# EasyEDA Pro project Ea-nāṣir ab.epro

# Schematic LM393DREOL_1
Board Name: LM393DREOL; Create Date: 2025-11-28; Page Name: P1; Project Name: LM393DREOL; Schematic Name: LM393DREOL; Update Date: 2025-11-29; Company: EasyEDA.com; Page Size: A4; Version: V1.0
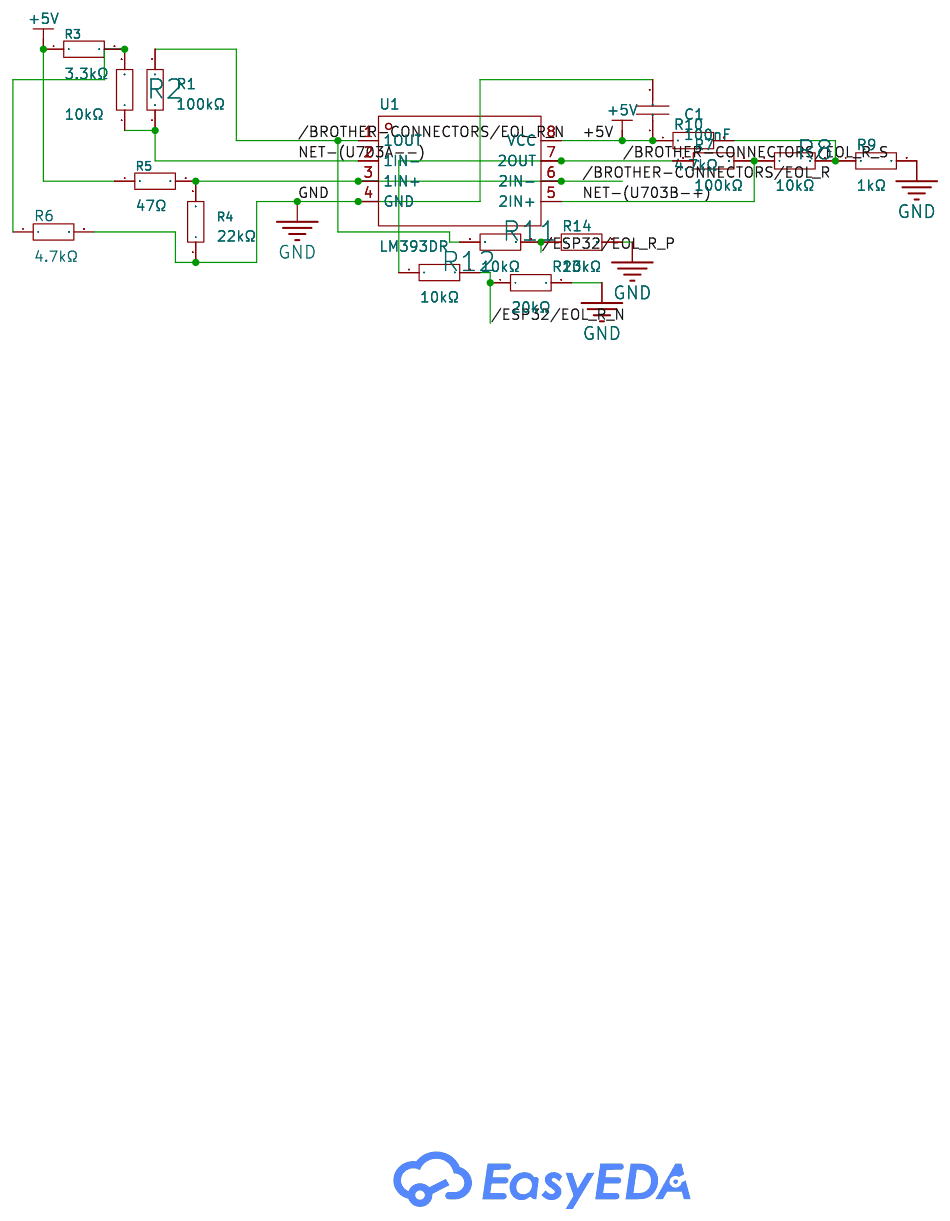
[diagram p0: schematic sheet]

## Parts
C1  100nF  [C0603]
R1  100kΩ  [R0603]
R2  10kΩ  [R0603]
R3  3.3kΩ  [R0603]
R4  22kΩ  [R0603]
R5  47Ω  [R0603]
R6  4.7kΩ  [R0603]
R7  100kΩ  [R0603]
R8  10kΩ  [R0603]
R9  1kΩ  [R0603]
R10  4.7kΩ  [R0603]
R11  10kΩ  [R0603]
R12  10kΩ  [R0603]
R13  20kΩ  [R0603]
R14  20kΩ  [R0603]
U1  LM393DR  [SOIC-8_L5.0-W4.0-P1.27-LS6.0-BL]

## Library data of the parts
C1 = CL10B104KA8NNNC: Capacitance:100nF Tolerance:±10% Tolerance:±10% Voltage Rating:25V Temperature Coefficient:X7R; LCSC Part Name: 100nF ±10% 25V; Supplier Part: C1590; Manufacturer: SAMSUNG(三星); Supplier Footprint: 0603; JLCPCB Part Class: Extended Part; Datasheet: https://item.szlcsc.com/datasheet/CL10B104KA8NNNC/1942.html; Supplier: LCSC; Tolerance: ±10%; Voltage Rating: 25V; Temperature Coefficient: X7R
R1 R7 = 0603WAF1003T5E: Type:Thick Film Resistor Resistance:100kΩ Tolerance:±1% Tolerance:±1% Power(Watts):100mW Voltage-Supply(Max):75V Temperature Coefficient:±100ppm/℃ Temperature Coefficient:±100ppm/℃ Operating Temperature:-55℃~+155℃ Operating Temperature:-55℃~+155℃; LCSC Part Name: 100kΩ ±1% 100mW 厚膜电阻; Supplier Part: C25803; Manufacturer: UNI-ROYAL(厚声); Supplier Footprint: 0603; JLCPCB Part Class: Basic Part; Datasheet: https://item.szlcsc.com/datasheet/0603WAF1003T5E/26546.html; Supplier: LCSC; Type: Thick Film Resistor; Tolerance: ±1%; Power(Watts): 100mW; Voltage-Supply(Max): 75V; Temperature Coefficient: ±100ppm/℃; Operating Temperature: -55℃~+155℃
R2 R8 R11 R12 = 0603WAF1002T5E: Type:Thick Film Resistor Resistance:10kΩ Tolerance:±1% Tolerance:±1% Power(Watts):100mW Voltage-Supply(Max):75V Temperature Coefficient:±100ppm/℃ Temperature Coefficient:±100ppm/℃ Operating Temperature:-55℃~+155℃ Operating Temperature:-55℃~+155℃; LCSC Part Name: 厚膜电阻 10kΩ ±1% 100mW; Supplier Part: C25804; Manufacturer: UNI-ROYAL(厚声); Supplier Footprint: 0603; JLCPCB Part Class: Basic Part; Datasheet: https://item.szlcsc.com/datasheet/0603WAF1002T5E/26547.html; Supplier: LCSC; Type: Thick Film Resistor; Tolerance: ±1%; Power(Watts): 100mW; Voltage-Supply(Max): 75V; Temperature Coefficient: ±100ppm/℃; Operating Temperature: -55℃~+155℃
R3 = 0603WAF3301T5E: Type:Thick Film Resistor Resistance:3.3kΩ Tolerance:±1% Tolerance:±1% Power(Watts):100mW Voltage-Supply(Max):75V Temperature Coefficient:±100ppm/℃ Temperature Coefficient:±100ppm/℃ Operating Temperature:-55℃~+155℃ Operating Temperature:-55℃~+155℃; LCSC Part Name: 3.3kΩ ±1% 100mW 厚膜电阻; Supplier Part: C22978; Manufacturer: UNI-ROYAL(厚声); Supplier Footprint: 0603; JLCPCB Part Class: Basic Part; Datasheet: https://item.szlcsc.com/datasheet/0603WAF3301T5E/23705.html; Supplier: LCSC; Type: Thick Film Resistor; Tolerance: ±1%; Power(Watts): 100mW; Voltage-Supply(Max): 75V; Temperature Coefficient: ±100ppm/℃; Operating Temperature: -55℃~+155℃
R4 = 0603WAF2202T5E: Type:Thick Film Resistor Resistance:22kΩ Tolerance:±1% Tolerance:±1% Power(Watts):100mW Voltage-Supply(Max):75V Temperature Coefficient:±100ppm/℃ Temperature Coefficient:±100ppm/℃ Operating Temperature:-55℃~+155℃ Operating Temperature:-55℃~+155℃; LCSC Part Name: 22kΩ ±1% 100mW 厚膜电阻; Supplier Part: C31850; Manufacturer: UNI-ROYAL(厚声); Supplier Footprint: 0603; JLCPCB Part Class: Basic Part; Datasheet: https://item.szlcsc.com/datasheet/0603WAF2202T5E/32812.html; Supplier: LCSC; Type: Thick Film Resistor; Tolerance: ±1%; Power(Watts): 100mW; Voltage-Supply(Max): 75V; Temperature Coefficient: ±100ppm/℃; Operating Temperature: -55℃~+155℃
R5 = 0603WAF470JT5E: Type:Thick Film Resistor Resistance:47Ω Tolerance:±1% Tolerance:±1% Power(Watts):100mW Voltage-Supply(Max):75V Temperature Coefficient:±100ppm/℃ Temperature Coefficient:±100ppm/℃ Operating Temperature:-55℃~+155℃ Operating Temperature:-55℃~+155℃; LCSC Part Name: 47Ω ±1% 100mW 厚膜电阻; Supplier Part: C23182; Manufacturer: UNI-ROYAL(厚声); Supplier Footprint: 0603; JLCPCB Part Class: Basic Part; Datasheet: https://item.szlcsc.com/datasheet/0603WAF470JT5E/23909.html; Supplier: LCSC; Type: Thick Film Resistor; Tolerance: ±1%; Power(Watts): 100mW; Voltage-Supply(Max): 75V; Temperature Coefficient: ±100ppm/℃; Operating Temperature: -55℃~+155℃
R6 R10 = 0603WAF4701T5E: Type:Thick Film Resistor Resistance:4.7kΩ Tolerance:±1% Tolerance:±1% Power(Watts):100mW Voltage-Supply(Max):75V Temperature Coefficient:±100ppm/℃ Temperature Coefficient:±100ppm/℃ Operating Temperature:-55℃~+155℃ Operating Temperature:-55℃~+155℃; LCSC Part Name: 4.7kΩ ±1% 100mW 厚膜电阻; Supplier Part: C23162; Manufacturer: UNI-ROYAL(厚声); Supplier Footprint: 0603; JLCPCB Part Class: Basic Part; Datasheet: https://item.szlcsc.com/datasheet/0603WAF4701T5E/23889.html; Supplier: LCSC; Type: Thick Film Resistor; Tolerance: ±1%; Power(Watts): 100mW; Voltage-Supply(Max): 75V; Temperature Coefficient: ±100ppm/℃; Operating Temperature: -55℃~+155℃
R9 = 0603WAF1001T5E: Type:Thick Film Resistor Resistance:1kΩ Tolerance:±1% Tolerance:±1% Power(Watts):100mW Voltage-Supply(Max):75V Temperature Coefficient:±100ppm/℃ Temperature Coefficient:±100ppm/℃ Operating Temperature:-55℃~+155℃ Operating Temperature:-55℃~+155℃; LCSC Part Name: 1kΩ ±1% 100mW 厚膜电阻; Supplier Part: C21190; Manufacturer: UNI-ROYAL(厚声); Supplier Footprint: 0603; JLCPCB Part Class: Basic Part; Datasheet: https://item.szlcsc.com/datasheet/0603WAF1001T5E/21904.html; Supplier: LCSC; Type: Thick Film Resistor; Tolerance: ±1%; Power(Watts): 100mW; Voltage-Supply(Max): 75V; Temperature Coefficient: ±100ppm/℃; Operating Temperature: -55℃~+155℃
R13 R14 = 0603WAF2002T5E: Type:Thick Film Resistor Resistance:20kΩ Tolerance:±1% Tolerance:±1% Power(Watts):100mW Voltage-Supply(Max):75V Temperature Coefficient:±100ppm/℃ Temperature Coefficient:±100ppm/℃ Operating Temperature:-55℃~+155℃ Operating Temperature:-55℃~+155℃; LCSC Part Name: 20kΩ ±1% 100mW 厚膜电阻; Supplier Part: C4184; Manufacturer: UNI-ROYAL(厚声); Supplier Footprint: 0603; JLCPCB Part Class: Basic Part; Datasheet: https://item.szlcsc.com/datasheet/0603WAF2002T5E/4591.html; Supplier: LCSC; Type: Thick Film Resistor; Tolerance: ±1%; Power(Watts): 100mW; Voltage-Supply(Max): 75V; Temperature Coefficient: ±100ppm/℃; Operating Temperature: -55℃~+155℃
U1 = LM393DR: Number of Channels:2 Vos - Input Offset Voltage:2mV Ib - Input Bias Current:25nA Propagation Delay Time:1.3us Input Hysteresis Voltage (Vhys):- Common Mode Rejection Ratio(CMRR):- Output Type:- Output Type:TTL；CMOS Quiescent Current:400uA Operating Temper; LCSC Part Name: 双通道差分比较器; Supplier Part: C67470; Manufacturer: TI(德州仪器); Supplier Footprint: SOIC-8; JLCPCB Part Class: Extended Part; Datasheet: https://www.ti.com/cn/lit/gpn/lm393; Supplier: LCSC; Number of Channels: 2; Vos - Input Offset Voltage: 2mV; Ib - Input Bias Current: 25nA; Propagation Delay Time: 1.3us; Output Type: TTL；CMOS; Quiescent Current: 400uA; Operating Temperature: 0℃~+70℃

## Nets
+5V: C1.1 R3.1 R5.1 R10.1 U1.8(VCC)
GND: C1.2 R4.1 R6.2 R9.2 R13.2 R14.2 U1.4(GND)
/BROTHER-CONNECTORS/EOL_R: R4.2 R5.2 U1.3(1IN+) U1.6(2IN-)
/BROTHER-CONNECTORS/EOL_R_N: R1.2 R11.1 U1.1(1OUT)
/BROTHER-CONNECTORS/EOL_R_S: R7.1 R12.1 U1.7(2OUT)
/ESP32/EOL_R_N: R12.2 R13.1
/ESP32/EOL_R_P: R11.2 R14.1
NET-(U703A--): R1.1 R2.1 U1.2(1IN-)
NET-(U703B-+): R7.2 R8.1 U1.5(2IN+)
$1N476: R2.2 R3.2 R6.1
$1N1029: R8.2 R9.1 R10.2

# Board LM393DREOL_1
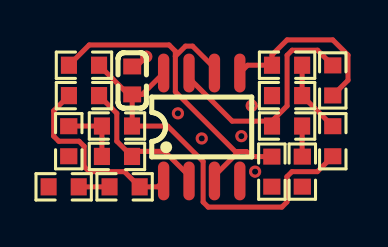
[diagram p1: board, top side]
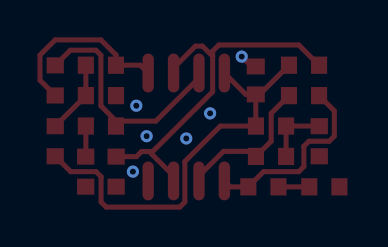
[diagram p2: board, bottom side, seen from below]

No outline. copper layers: Top Layer, Bottom Layer. Coordinates in mm from the lowest, leftmost part position.
Stack: Top Layer 0.035mm / Dielectric1 1.51mm FR4 er 4.5 / Bottom Layer 0.035mm

## Design rules (mm)
template: JLCPCB Capability(Two Layers Board)
spacing copperThickness1oz (default): track to track 0.102, other pairs 0.152 to 0.3
spacing copperThickness2oz: track to track 0.203, other pairs 0.152 to 0.3
track width copperThickness1oz (default): min 0.127, default 0.254, max 2.54
track width copperThickness2oz: min 0.203, default 0.254, max 2.54
differential pair differentialPair (default): width min 0.127, default 0.254, max 2.54; gap min 0.152, default 0.152
via viaSize (default): diameter min 0.5, default 0.61, max 10; hole min 0.3, default 0.305, max 6.3

## Placement (name value [footprint] x y rotation side)
C1  100nF  [C0603]  3.43 5.33 90 top
R1  100kΩ  [R0603]  1.02 4.57 180 top
R2  10kΩ  [R0603]  2.67 1.52 180 top
R3  3.3kΩ  [R0603]  2.67 3.05 180 top
R4  22kΩ  [R0603]  10.41 0.76 90 top
R5  47Ω  [R0603]  1.02 6.1 180 top
R6  4.7kΩ  [R0603]  0.25 2.29 270 top
R7  100kΩ  [R0603]  13.46 5.33 270 top
R8  10kΩ  [R0603]  11.18 6.1 0 top
R9  1kΩ  [R0603]  11.18 4.57 180 top
R10  4.7kΩ  [R0603]  13.46 2.29 90 top
R11  10kΩ  [R0603]  3.05 0 180 top
R12  10kΩ  [R0603]  11.18 3.05 0 top
R13  20kΩ  [R0603]  11.94 0.76 270 top
R14  20kΩ  [R0603]  0 0 180 top
U1  LM393DR  [SOIC-8_L5.0-W4.0-P1.27-LS6.0-BL]  6.91 3 0 top

## Footprints (pads in the part's own frame, mm; a bottom-side part is the same pattern mirrored in y, then rotated)
C0603
  rect 0.8x0.9 smd: 1(-0.7,0) 2(0.7,0)
R0603
  rect 0.806x0.864 smd: 1(-0.753,0) 2(0.753,0)
SOIC-8_L5.0-W4.0-P1.27-LS6.0-BL
  oval 0.569x1.95 smd: 1(-1.905,-2.705) 2(-0.635,-2.705) 3(0.635,-2.705) 4(1.905,-2.705) 5(1.905,2.705) 6(0.635,2.705) 7(-0.635,2.705) 8(-1.905,2.705)

## Nets
As in the schematic.

## Via types
v1: diameter 0.61, hole 0.305, Top Layer to Bottom Layer, 6 vias

## Routing (per net, layer and track width the routed paths; a pad name or vN(x,y) marks a point on that pad's centre or on a via; arc(x,y) is an arc through that point)
+5V: length 20.6
  Top Layer w0.254: C1.1 3.23,4.63 R5.1 ; C1.1 3.93,4.63 U1.8 ; C1.1 3.43,3.06 R3.1 5.2,3.05 6.98,1.27 6.98,-0.76 7.23,-1.02 10.91,-1.02 11.17,-0.76 11.17,0.51 11.42,0.76 12.69,0.76 R10.1
GND: length 0.9
  Top Layer w0.254: 3.43,6.03 3.64,6.03 v1(4.13,6.53)
  vias: v1(5.72,3.68) v1(6.91,2.43) v1(8.89,2.54) v1(9.41,4.07) v1(9.58,0.76)
/BROTHER-CONNECTORS/EOL_R: length 18.9
  Top Layer w0.254: 7.54,0.3 7.54,0.55 8.76,1.77 ; 5.59,6.55 5.59,6.8 5.27,7.11 1.28,7.11 R5.2 ; 5.59,6.55 5.59,4.77 8.58,1.77 8.76,1.77 ; 5.59,6.55 6.09,7.05 6.45,7.05 7.54,5.96 U1.6 ; R4.2 9.4,1.52 9.14,1.77 8.76,1.77
/BROTHER-CONNECTORS/EOL_R_N: length 9.6
  Top Layer w0.254: 5,0.3 4.71,0 R11.1 3.04,0.76 1.28,0.76 1.02,1.02 1.02,2.03 0.77,2.29 -0.25,2.29 -0.5,2.54 -0.5,3.81 R1.2
/BROTHER-CONNECTORS/EOL_R_S: length 11.9
  Top Layer w0.254: R7.1 12.7,6.85 11.43,6.85 11.18,6.6 11.18,4.06 10.41,3.29 ; R12.1 10.41,3.06 10.41,3.29 ; 10.41,3.29 8.43,3.29 6.35,5.37 6.35,5.63 U1.7
/ESP32/EOL_R_N: length 1.5
  Top Layer w0.254: R12.2 11.93,1.52 R13.1
/ESP32/EOL_R_P: length 1.5
  Top Layer w0.254: R11.2 R14.1
NET-(U703A--): length 7.5
  Top Layer w0.254: 6.27,0.3 6.27,0.55 5.04,1.78 3.67,1.78 R2.1 2.66,2.29 2.66,3.68 R1.1
NET-(U703B-+): length 9.1
  Top Layer w0.254: R7.2 14.22,5.34 14.22,6.6 13.46,7.37 11.18,7.37 10.42,6.61 R8.1 9.2,6.1 U1.5
$1N476: length 3.2
  Top Layer w0.254: R6.1 0.26,3.05 R3.2 R2.2
$1N1029: length 3.7
  Top Layer w0.254: R10.2 R9.1 R8.2

# Board PCB1
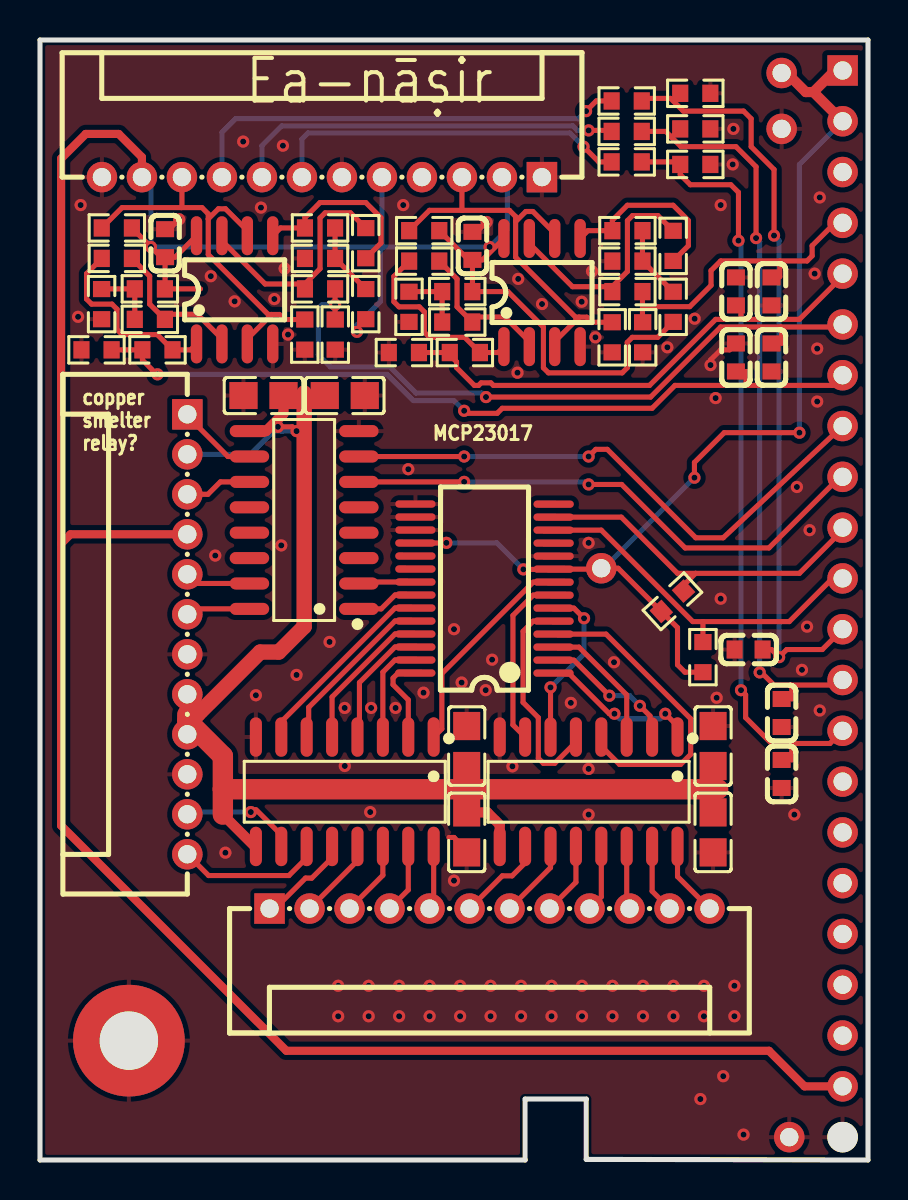
[diagram p3: board, top side]
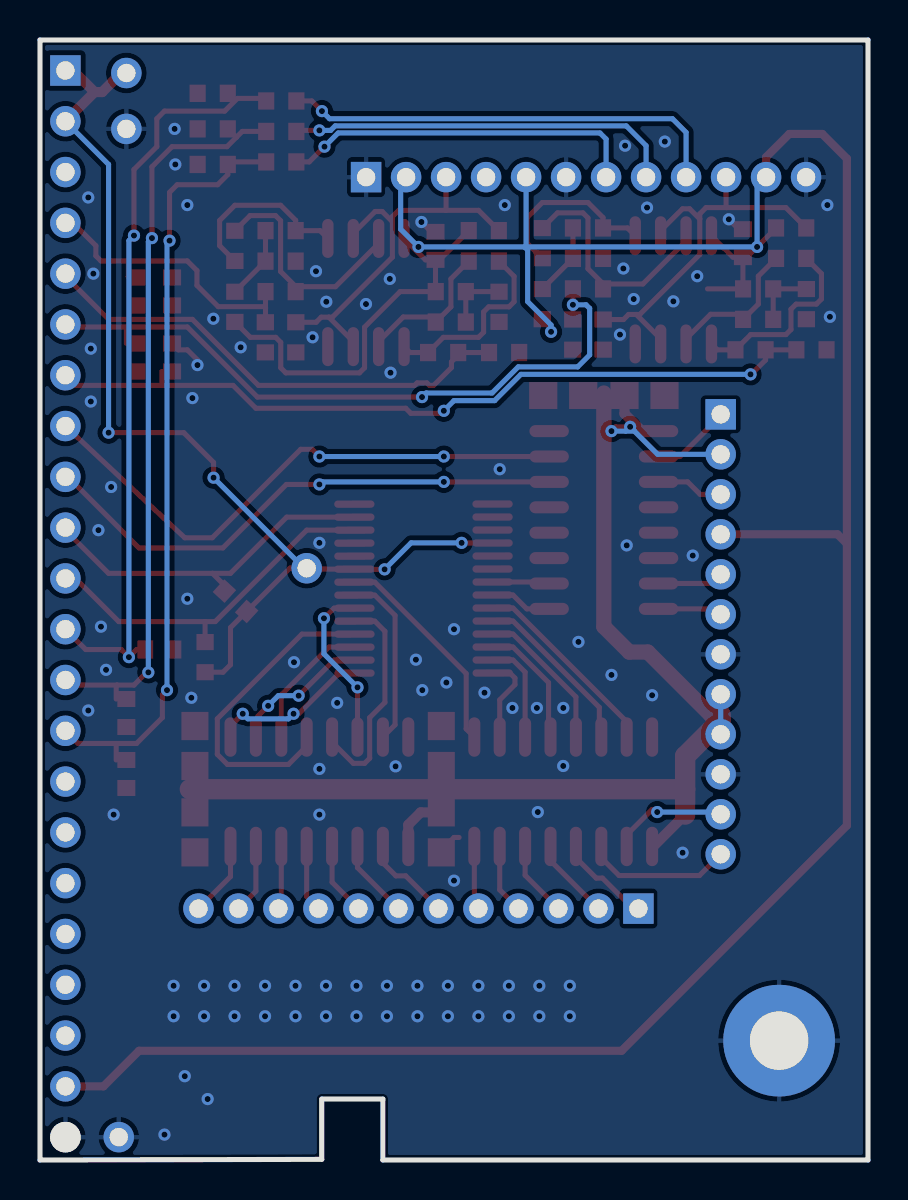
[diagram p4: board, bottom side, seen from below]

Outline 41.4 x 56.01 mm; copper layers: Top Layer, Bottom Layer. Coordinates in mm from the lower left corner of the outline.
Outline path: 0,56.01 0,0 24.26,0 24.26,3.05 27.31,3.05 27.31,0.03 41.4,0 41.4,56.01 0,56.01
Stack: Top Layer 0.035mm / Dielectric1 1.51mm FR4 er 4.5 / Bottom Layer 0.035mm

## Design rules (mm)
template: JLCPCB Capability(Two Layers Board)
spacing copperThickness1oz (default): track to track 0.102, other pairs 0.152 to 0.3
spacing copperThickness2oz: track to track 0.203, other pairs 0.152 to 0.3
track width copperThickness1oz (default): min 0.127, default 0.254, max 2.54
track width copperThickness2oz: min 0.203, default 0.254, max 2.54
differential pair differentialPair (default): width min 0.127, default 0.254, max 2.54; gap min 0.152, default 0.152
via viaSize (default): diameter min 0.5, default 0.61, max 10; hole min 0.3, default 0.305, max 6.3

## Placement (name value [footprint] x y rotation side)
1  5.1kΩ  [R0603]  33.15 25.15 90 top
3  10kΩ  [R0603]  5.49 42.04 180 top
4  10kΩ  [R0603]  20.86 41.9 180 top
5  10kΩ  [R0603]  29.34 51.44 0 top
6  10kΩ  [R0603]  29.34 49.91 0 top
7  3.3kΩ  [R0603]  5.49 43.56 180 top
8  3.3kΩ  [R0603]  20.86 43.43 180 top
9  20kΩ  [R0603]  32.77 53.34 0 top
10  22kΩ  [R0603]  13.24 41.28 90 top
11  22kΩ  [R0603]  28.61 41.14 90 top
12  47Ω  [R0603]  3.84 46.61 180 top
13  47Ω  [R0603]  19.21 46.47 180 top
14  20kΩ  [R0603]  32.77 51.56 0 top
15  20kΩ  [R0603]  32.77 49.78 0 top
16  4.7kΩ  [R0603]  3.08 42.8 270 top
17  4.7kΩ  [R0603]  18.45 42.66 270 top
18  100kΩ  [R0603]  16.29 45.85 270 top
19  100kΩ  [R0603]  31.66 45.71 270 top
20  10kΩ  [R0603]  14 46.61 0 top
21  10kΩ  [R0603]  29.37 46.47 0 top
22  5.1kΩ  [R0603]  31.62 27.94 42.5 top
23  1kΩ  [R0603]  14 45.08 180 top
24  1kΩ  [R0603]  29.37 44.95 180 top
25  4.7kΩ  [R0603]  16.29 42.8 90 top
26  4.7kΩ  [R0603]  31.66 42.66 90 top
27  10kΩ  [R0603]  5.87 40.51 180 top
28  10kΩ  [R0603]  21.24 40.38 180 top
29  10kΩ  [R0603]  14 43.56 0 top
30  10kΩ  [R0603]  29.37 43.43 0 top
40  20kΩ  [R0603]  14.76 41.28 270 top
41  20kΩ  [R0603]  30.13 41.14 270 top
42  20kΩ  [R0603]  2.83 40.51 180 top
43  20kΩ  [R0603]  18.2 40.38 180 top
C1aaa  100nF  [C0603]  6.25 45.85 90 top
C1aaa1  100nF  [C0603]  34.8 43.43 90 top
C1aaa2JS20T-S12PHW-00  100nF  [C0603]  36.58 43.43 270 top
C1aaac  100nF  [C0603]  34.8 40.13 90 top
C1aaad  100nF  [C0603]  36.58 40.13 270 top
C1aaax  100nF  [C0603]  37.08 22.35 270 top
C1aaay  100nF  [C0603]  37.08 19.3 270 top
C1aaaz  100nF  [C0603]  35.43 25.53 180 top
C1bbb  100nF  [C0603]  21.62 45.71 90 top
cc1  10uF  [C0805]  21.34 20.7 90 top
cc2  10uF  [C0805]  21.34 16.38 90 top
cc3  10uF  [C0805]  33.66 16.38 90 top
cc4  10uF  [C0805]  33.66 20.7 90 top
cc5  10uF  [C0805]  11.18 38.23 180 top
cc6  10uF  [C0805]  15.24 38.23 0 top
ghfg  100kΩ  [R0603]  3.84 45.08 180 top
j1  ZX-PH2.0-WZ12P  [CONN-TH_12P-P2.00_ZX-PH2.0-WZ12P]  7.37 26.29 270 top
j2  ZX-PH2.0-WZ12P  [CONN-TH_12P-P2.00_ZX-PH2.0-WZ12P]  14.1 49.15 180 top
j3  ZX-PH2.0-WZ12P  [CONN-TH_12P-P2.00_ZX-PH2.0-WZ12P]  22.48 12.57 0 top
jhmk  100kΩ  [R0603]  19.21 44.95 180 top
MCP23017  MCP23017T-E/SS  [SSOP-28_L10.2-W5.3-P0.65-LS7.8-BL]  22.22 28.58 90 top
NOREF  -  [Pad_e4395]  40.13 54.48 0 top
NOREF#2  -  [Pad_e4241]  37.46 1.14 0 top
NOREF#3  -  [Pad_e4385]  40.13 29.08 0 top
NOREF#4  -  [Pad_e4384]  40.13 26.54 0 top
NOREF#5  -  [Pad_e4376]  40.13 6.22 0 top
NOREF#6  -  [Pad_e4379]  40.13 13.84 0 top
NOREF#7  -  [Pad_e4461]  37.08 51.56 0 top
NOREF#8  -  [Pad_e4387]  40.13 34.16 0 top
NOREF#9  -  [Pad_e965]  4.44 5.97 0 top
NOREF#10  -  [Pad_e4388]  40.13 36.7 0 top
NOREF#11  -  [Pad_e4380]  40.13 16.38 0 top
NOREF#12  -  [Pad_e4382]  40.13 21.46 0 top
NOREF#13  -  [Pad_e4373]  40.13 1.14 0 top
NOREF#14  -  [Pad_e4057]  28.07 29.59 0 top
NOREF#15  -  [Pad_e4389]  40.13 39.24 0 top
NOREF#16  -  [Pad_e4392]  40.13 46.86 0 top
NOREF#17  -  [Pad_e4381]  40.13 18.92 0 top
NOREF#18  -  [Pad_e3515]  37.08 54.36 0 top
NOREF#19  -  [Pad_e4378]  40.13 11.3 0 top
NOREF#20  -  [Pad_e4375]  40.13 3.68 0 top
NOREF#21  -  [Pad_e4377]  40.13 8.76 0 top
NOREF#22  -  [Pad_e4386]  40.13 31.62 0 top
NOREF#23  -  [Pad_e4393]  40.13 49.4 0 top
NOREF#24  -  [Pad_e4391]  40.13 44.32 0 top
NOREF#25  -  [Pad_e4383]  40.13 24 0 top
NOREF#26  -  [Pad_e4390]  40.13 41.78 0 top
NOREF#27  -  [Pad_e4394]  40.13 51.94 0 top
R1dfghdf  10kΩ  [R0603]  29.34 52.96 0 top
u2  LM393DR  [SOIC-8_L5.0-W4.0-P1.27-LS6.0-BL]  9.73 43.51 0 top
u3  LM393DR  [SOIC-8_L5.0-W4.0-P1.27-LS6.0-BL]  25.1 43.38 0 top
U4  ULN2003ADR  [SOIC-16_L9.9-W3.9-P1.27-LS6.0-BL]  15.24 18.42 180 top
ul1  ULN2003ADR  [SOIC-16_L9.9-W3.9-P1.27-LS6.0-BL]  27.43 18.42 180 top
un2  ULN2003ADR  [SOIC-16_L9.9-W3.9-P1.27-LS6.0-BL]  13.21 32 90 top

## Footprints (pads in the part's own frame, mm; a bottom-side part is the same pattern mirrored in y, then rotated)
C0603
  rect 0.8x0.9 smd: 1(-0.7,0) 2(0.7,0)
C0805
  rect 1.41x1.35 smd: 1(-1,0) 2(1,0)
CONN-TH_12P-P2.00_ZX-PH2.0-WZ12P
  rect 1.524x1.524 hole 0.914: 1(-11,0)
  round 1.524 hole 0.914: 2(-9,0) 3(-7,0) 4(-5,0) 5(-3,0) 6(-1,0) 7(1,0) 8(3,0) 9(5,0) 10(7,0) 11(9,0) 12(11,0)
Pad_e965
  round 5.588 hole 2.921: 1(0,0)
Pad_e3515
  round 1.524 hole 0.914: 1(0,0)
Pad_e4057
  round 1.524 hole 0.914: 1(0,0)
Pad_e4241
  round 1.524 hole 0.914: 1(0,0)
Pad_e4373
  round 1.524 hole 2.921x0.914: 1(0,0)
Pad_e4375
  round 1.524 hole 0.914: 1(0,0)
Pad_e4376
  round 1.524 hole 0.914: 1(0,0)
Pad_e4377
  round 1.524 hole 0.914: 1(0,0)
Pad_e4378
  round 1.524 hole 0.914: 1(0,0)
Pad_e4379
  round 1.524 hole 0.914: 1(0,0)
Pad_e4380
  round 1.524 hole 0.914: 1(0,0)
Pad_e4381
  round 1.524 hole 0.914: 1(0,0)
Pad_e4382
  round 1.524 hole 0.914: 1(0,0)
Pad_e4383
  round 1.524 hole 0.914: 1(0,0)
Pad_e4384
  round 1.524 hole 0.914: 1(0,0)
Pad_e4385
  round 1.524 hole 0.914: 1(0,0)
Pad_e4386
  round 1.524 hole 0.914: 1(0,0)
Pad_e4387
  round 1.524 hole 0.914: 1(0,0)
Pad_e4388
  round 1.524 hole 0.914: 1(0,0)
Pad_e4389
  round 1.524 hole 0.914: 1(0,0)
Pad_e4390
  round 1.524 hole 0.914: 1(0,0)
Pad_e4391
  round 1.524 hole 0.914: 1(0,0)
Pad_e4392
  round 1.524 hole 0.914: 1(0,0)
Pad_e4393
  round 1.524 hole 0.914: 1(0,0)
Pad_e4394
  round 1.524 hole 0.914: 1(0,0)
Pad_e4395
  rect 1.524x1.524 hole 0.914: 1(0,0)
Pad_e4461
  round 1.524 hole 0.914: 1(0,0)
R0603
  rect 0.806x0.864 smd: 1(-0.753,0) 2(0.753,0)
SOIC-8_L5.0-W4.0-P1.27-LS6.0-BL
  oval 0.569x1.95 smd: 1(-1.905,-2.705) 2(-0.635,-2.705) 3(0.635,-2.705) 4(1.905,-2.705) 5(1.905,2.705) 6(0.635,2.705) 7(-0.635,2.705) 8(-1.905,2.705)
SOIC-16_L9.9-W3.9-P1.27-LS6.0-BL
  oval 0.602x1.971 smd: 1(-4.445,-2.736) 2(-3.175,-2.736) 3(-1.905,-2.736) 4(-0.635,-2.736) 5(0.635,-2.736) 6(1.905,-2.736) 7(3.175,-2.736) 8(4.445,-2.736) 9(4.445,2.736) 10(3.175,2.736) 11(1.905,2.736) 12(0.635,2.736) 13(-0.635,2.736) 14(-1.905,2.736) 15(-3.175,2.736) 16(-4.445,2.736)
SSOP-28_L10.2-W5.3-P0.65-LS7.8-BL
  oval 0.364x2.015 smd: 1(-4.225,-3.455) 2(-3.575,-3.455) 3(-2.925,-3.455) 4(-2.275,-3.455) 5(-1.625,-3.455) 6(-0.975,-3.455) 7(-0.325,-3.455) 8(0.325,-3.455) 9(0.975,-3.455) 10(1.625,-3.455) 11(2.275,-3.455) 12(2.925,-3.455) 13(3.575,-3.455) 14(4.225,-3.455) 15(4.225,3.455) 16(3.575,3.455) 17(2.925,3.455) 18(2.275,3.455) 19(1.625,3.455) 20(0.975,3.455) 21(0.325,3.455) 22(-0.325,3.455) 23(-0.975,3.455) 24(-1.625,3.455) 25(-2.275,3.455) 26(-2.925,3.455) 27(-3.575,3.455) 28(-4.225,3.455)

## Nets
+3V3: 1.1 22.1 MCP23017.9 MCP23017.18 NOREF.1 NOREF#14.1 NOREF#18.1 NOREF#27.1
+5V: 7.1 8.1 12.1 13.1 25.1 26.1 C1aaa.1 C1bbb.1 j1.4 j2.2 j2.5 j2.11 NOREF#20.1 u2.8 u3.8
+12V: cc1.1 cc2.2 cc3.2 cc4.1 cc5.1 cc6.1 j1.2 j1.8 j1.9 U4.9 ul1.9 un2.9
GND: 9.2 10.1 11.1 14.2 15.2 16.2 17.2 23.2 24.2 40.2 41.2 42.2 43.2 C1aaa.2 C1aaa1.2 C1aaa2JS20T-S12PHW-00.2 C1aaac.2 C1aaad.2 C1aaax.2 C1aaay.2 C1aaaz.2 C1bbb.2 cc1.2 cc2.1 cc3.1 cc4.2 cc5.2 cc6.2 j1.7 j1.10 j2.1 j2.6 j2.12 MCP23017.10 MCP23017.15 MCP23017.16 MCP23017.17 NOREF#2.1 NOREF#7.1 NOREF#9.1 NOREF#13.1 u2.4 u3.4 U4.8 ul1.8 un2.8
/AUX-CONNECTORS/AYAB_SCL: 1.2 MCP23017.12 NOREF#3.1
/AUX-CONNECTORS/AYAB_SDA: 22.2 MCP23017.13 NOREF#22.1
/BROTHER-CONNECTORS/ENC_BELTPHASE: j2.9 R1dfghdf.1
/BROTHER-CONNECTORS/ENC_V1: 5.1 j2.8
/BROTHER-CONNECTORS/ENC_V2: 6.1 j2.7
/BROTHER-CONNECTORS/EOL_L: 10.2 12.2 j2.10 u2.3 u2.6
/BROTHER-CONNECTORS/EOL_L_N: 27.1 ghfg.2 u2.1
/BROTHER-CONNECTORS/EOL_L_S: 18.1 29.1 u2.7
/BROTHER-CONNECTORS/EOL_R: 11.2 13.2 j2.3 u3.3 u3.6
/BROTHER-CONNECTORS/EOL_R_N: 28.1 jhmk.2 u3.1
/BROTHER-CONNECTORS/EOL_R_S: 19.1 30.1 u3.7
/BROTHER-CONNECTORS/SOL_0: j3.5 U4.16
/BROTHER-CONNECTORS/SOL_1: j3.6 ul1.10
/BROTHER-CONNECTORS/SOL_2: j3.7 ul1.11
/BROTHER-CONNECTORS/SOL_3: j3.8 ul1.12
/BROTHER-CONNECTORS/SOL_4: j3.9 ul1.13
/BROTHER-CONNECTORS/SOL_5: j3.10 ul1.14
/BROTHER-CONNECTORS/SOL_6: j3.11 ul1.15
/BROTHER-CONNECTORS/SOL_7: j3.12 ul1.16
/BROTHER-CONNECTORS/SOL_8: j1.5 un2.15
/BROTHER-CONNECTORS/SOL_9: j1.6 un2.16
/BROTHER-CONNECTORS/SOL_A: j1.11 U4.10
/BROTHER-CONNECTORS/SOL_B: j1.12 U4.11
/BROTHER-CONNECTORS/SOL_C: j3.1 U4.12
/BROTHER-CONNECTORS/SOL_D: j3.2 U4.13
/BROTHER-CONNECTORS/SOL_E: j3.3 U4.14
/BROTHER-CONNECTORS/SOL_F: j3.4 U4.15
/ESP32/ENC_A: 5.2 14.1 C1aaax.1 NOREF#25.1
/ESP32/ENC_B: 6.2 15.1 C1aaay.1 NOREF#12.1
/ESP32/ENC_BP: 9.1 C1aaaz.1 NOREF#4.1 R1dfghdf.2
/ESP32/EOL_L_N: 29.2 40.1 C1aaad.1 NOREF#26.1
/ESP32/EOL_L_P: 27.2 42.1 C1aaac.1 NOREF#15.1
/ESP32/EOL_R_N: 30.2 41.1 C1aaa2JS20T-S12PHW-00.1 NOREF#16.1
/ESP32/EOL_R_P: 28.2 43.1 C1aaa1.1 NOREF#24.1
/SOLENOID DRIVERS/MCU_SOL_0: MCP23017.8 U4.1
/SOLENOID DRIVERS/MCU_SOL_1: MCP23017.7 ul1.7
/SOLENOID DRIVERS/MCU_SOL_2: MCP23017.6 ul1.6
/SOLENOID DRIVERS/MCU_SOL_3: MCP23017.5 ul1.5
/SOLENOID DRIVERS/MCU_SOL_4: MCP23017.4 ul1.4
/SOLENOID DRIVERS/MCU_SOL_5: MCP23017.3 ul1.3
/SOLENOID DRIVERS/MCU_SOL_6: MCP23017.2 ul1.2
/SOLENOID DRIVERS/MCU_SOL_7: MCP23017.1 ul1.1
/SOLENOID DRIVERS/MCU_SOL_8: MCP23017.21 un2.2
/SOLENOID DRIVERS/MCU_SOL_9: MCP23017.22 un2.1
/SOLENOID DRIVERS/MCU_SOL_A: MCP23017.23 U4.7
/SOLENOID DRIVERS/MCU_SOL_B: MCP23017.24 U4.6
/SOLENOID DRIVERS/MCU_SOL_C: MCP23017.25 U4.5
/SOLENOID DRIVERS/MCU_SOL_D: MCP23017.26 U4.4
/SOLENOID DRIVERS/MCU_SOL_E: MCP23017.27 U4.3
/SOLENOID DRIVERS/MCU_SOL_F: MCP23017.28 U4.2
BUZZER: NOREF#8.1 un2.6
BUZZER12V: j1.3 un2.11
NET-(U703A1--): 3.1 ghfg.1 u2.2
NET-(U703A--): 4.1 jhmk.1 u3.2
NET-(U703B1-+): 18.2 20.1 u2.5
NET-(U703B-+): 19.2 21.1 u3.5
SPARE: NOREF#10.1 un2.7
SPARE12V: j1.1 un2.10
$1N476: 4.2 8.2 17.1
$1N1029: 21.2 24.1 26.2
$1N4761: 3.2 7.2 16.1
$1N10291: 20.2 23.1 25.2

Pads without a net: j2 4; MCP23017 11 14 19 20; NOREF#5 1; NOREF#6 1; NOREF#11 1; NOREF#17 1; NOREF#19 1; NOREF#21 1; NOREF#23 1; un2 3 4 5 12 13 14

## Via types
v1: diameter 0.61, hole 0.305, Top Layer to Bottom Layer, 126 vias

## Routing (per net, layer and track width the routed paths; a pad name or vN(x,y) marks a point on that pad's centre or on a via; arc(x,y) is an arc through that point)
+3V3: length 53.9
  Top Layer w0.254: v1(20.32,30.86) 20.31,30.85 MCP23017.18 ; NOREF#14.1 28.19,29.59 ; 28.19,29.59 28.15,29.55 MCP23017.9 25.67,29.53 v1(24.17,29.53) ; 28.19,29.59 28.91,29.59 22.1 31.88,26.62 31.88,24.77 32.25,24.39 1.1 ; v1(32.72,34.12) 32.72,34.88 34.21,36.37 v1(37.97,36.37)
  Top Layer w0.508: 38.67,53.4 NOREF#27.1 ; 38.67,53.4 38.29,53.4 37.08,54.61 ; 38.67,53.4 39.75,54.48 NOREF.1
  Bottom Layer w0.254: v1(37.97,36.37) 37.97,49.78 NOREF#27.1 ; v1(20.32,30.86) 22.85,30.86 v1(24.17,29.53) ; v1(32.72,34.12) 28.19,29.59
+5V: length 151.5
  Top Layer w0.254: u3.8 22.13,45.01 C1bbb.1 ; C1bbb.1 21.62,43.43 8.1 23.39,43.43 25.17,41.65 25.17,39.62 25.43,39.36 29.11,39.36 29.36,39.62 29.36,40.89 29.62,41.14 30.89,41.14 26.1 ; C1bbb.1 21.43,45.01 13.1 ; C1aaa.1 6.25,43.57 7.1 8.02,43.56 ; C1aaa.1 6.76,45.15 u2.8 ; C1aaa.1 6.06,45.15 v1(5.55,45.66) 12.1
  Top Layer w0.406: 1.06,30.82 1.06,16.72 12.32,5.46 36.45,5.46 38.23,3.68 NOREF#20.1 ; 1.06,30.82 1.52,31.29 j1.4 ; 1.06,30.82 1.06,50.08 2.29,51.31 3.94,51.31 5.1,50.15 j2.11
  Bottom Layer w0.254: 17.18,45.66 17.02,45.5 17.02,42.93 15.85,41.76 v1(15.85,41.41) ; 17.18,45.66 v1(22.48,45.66) 23.37,46.55 23.37,48.88 j2.2 ; 17.18,45.66 17.1,45.74 j2.5 ; 17.18,45.66 v1(5.55,45.66) 5.55,48.7 j2.11
+12V: length 68.7
  Top Layer w0.254: v1(11.89,36.66) 12.61,36.66 v1(12.83,36.45)
  Top Layer w0.508: U4.9 10.74,15.68 9.14,17.27 ; cc5.1 12.18,37.32 11.3,36.45 un2.9 ; ul1.9 22.99,16.76 22.37,17.38 cc2.2
  Top Layer w0.762: 13.21,38.35 13.21,26.67 11.94,25.4 11.01,25.4 7.87,22.26 7.37,22.26 j1.8
  Top Layer w1.016: 9.14,18.54 33.91,18.54 ; 9.14,18.54 9.14,20.19 7.37,21.97 7.37,22.26 ; 9.14,18.54 9.14,17.27
  Bottom Layer w0.254: j1.2 10.52,35.29 11.68,36.45 ; 11.68,36.45 v1(11.89,36.66) 12.11,36.45 ; 11.68,36.45 12.11,36.45 ; 12.11,36.45 v1(12.83,36.45) ; j1.8 j1.9
GND: length 4.9
  Top Layer w0.254: v1(6.96,47.04) 6.47,46.55 C1aaa.2 ; v1(22.33,46.91) 21.84,46.41 C1bbb.2 ; v1(33.53,39.75) 33.53,40 34.04,40.51 34.48,40.51 34.8,40.83 ; cc2.1 21.34,15.49 20.7,16.13 20.45,16.13
  vias: v1(1.91,42.16) v1(2.03,47.75) v1(8.54,44.2) v1(8.76,30.23) v1(9.27,15.37) v1(9.73,42.94) v1(10.16,50.93) v1(10.79,23.24) v1(11.05,47.62) v1(11.72,43.05) v1(12.06,30.73) v1(12.15,50.72) v1(12.23,44.58) v1(12.4,41.28) v1(12.83,24.26) v1(14.48,25.91) v1(14.91,8.71) v1(14.91,7.19) v1(15.24,22.61) v1(15.24,19.7) v1(16.51,17.4) v1(16.43,8.71) v1(16.43,7.19) v1(16.56,22.61) v1(17.78,22.61) v1(17.96,8.71) v1(17.96,7.19) v1(18.16,47.75) v1(18.41,34.54) v1(19.18,23.37) v1(19.48,8.71) v1(19.48,7.19) v1(20.7,26.54) v1(20.7,13.97) v1(21.01,8.71) v1(21.01,7.19) v1(21.08,23.88) v1(22.29,23.5) v1(22.61,25.02) v1(22.53,8.71) v1(22.53,7.19) v1(23.62,19.69) v1(23.91,44.06) v1(23.88,39.37) v1(24.05,8.71) v1(24.05,7.19) v1(25.1,42.8) v1(25.58,8.71) v1(25.58,7.19) v1(26.54,22.86) v1(27.09,42.92) v1(27.1,8.71) v1(27.1,7.19) v1(27.43,30.86) v1(27.43,19.56) v1(27.43,17.27) v1(27.6,44.44) v1(27.77,41.14) v1(28.7,24.89) v1(28.63,8.71) v1(28.63,7.19) v1(30.15,8.71) v1(30.15,7.19) v1(31.37,40.64) v1(31.67,8.71) v1(31.67,7.19) v1(32.73,42.07) v1(33.02,3.05) v1(33.2,8.71) v1(33.2,7.19) v1(33.78,38.1) v1(33.83,23.11) v1(34.04,47.75) v1(34.04,28.07) v1(34.16,4.19) v1(34.67,51.56) v1(34.64,49.78) v1(34.72,8.71) v1(34.72,7.19) v1(35.18,1.27) v1(37.72,17.27) v1(37.85,33.66) v1(38.1,24.51) v1(38.35,26.67) v1(38.48,31.5) v1(38.73,44.32) v1(38.86,40.57) v1(38.86,37.93) v1(38.99,48.13) v1(38.99,22.48)
/AUX-CONNECTORS/AYAB_SCL: length 18.3
  Top Layer w0.254: 33.15,26.92 32.64,26.92 28.07,31.5 MCP23017.12 ; 33.15,26.92 37.46,26.92 39.62,29.08 NOREF#3.1 ; 33.15,26.92 1.2
/AUX-CONNECTORS/AYAB_SDA: length 17.8
  Top Layer w0.254: 22.2 32.18,28.74 32.78,29.34 ; NOREF#22.1 40.13,31.5 37.97,29.34 32.78,29.34 ; 32.78,29.34 31.88,29.34 29.07,32.15 MCP23017.13
/BROTHER-CONNECTORS/ENC_BELTPHASE: length 22.4
  Top Layer w0.254: v1(27.3,52.45) 27.81,52.96 R1dfghdf.1
  Bottom Layer w0.254: j2.9 9.1,51.39 9.78,52.07 26.92,52.07 v1(27.3,52.45)
/BROTHER-CONNECTORS/ENC_V1: length 19.6
  Top Layer w0.254: v1(27.43,51.49) 28.53,51.49 5.1
  Bottom Layer w0.254: v1(27.43,51.49) 26.87,51.49 26.64,51.71 12.09,51.71 11.1,50.72 j2.8
/BROTHER-CONNECTORS/ENC_V2: length 18.1
  Top Layer w0.254: v1(27.18,50.67) 27.94,49.91 6.1
  Bottom Layer w0.254: j2.7 13.1,51.05 13.4,51.36 26.49,51.36 v1(27.18,50.67)
/BROTHER-CONNECTORS/EOL_L: length 20.5
  Top Layer w0.254: 11.59,42.28 11.97,42.28 12.22,42.03 10.2 ; 11.59,42.28 11.41,42.28 8.41,45.28 8.41,47.06 ; 11.59,42.28 10.37,41.06 u2.3 ; u2.6 10.37,46.47 9.27,47.57 8.92,47.57 8.41,47.06 ; 8.41,47.06 8.41,47.31 8.1,47.62 7.07,47.62 ; j2.10 7.1,47.65 7.07,47.62 ; 12.2 4.1,47.62 7.07,47.62
/BROTHER-CONNECTORS/EOL_L_N: length 9.6
  Top Layer w0.254: u2.1 7.53,40.51 27.1 5.87,41.28 4.1,41.28 3.85,41.53 3.85,42.55 3.6,42.8 2.58,42.8 2.33,43.05 2.33,44.32 ghfg.2
/BROTHER-CONNECTORS/EOL_L_S: length 11.6
  Top Layer w0.254: 18.1 15.53,47.36 14.26,47.36 14,47.11 14,44.57 13.24,43.81 11.26,43.81 9.18,45.89 9.18,46.14 u2.7
/BROTHER-CONNECTORS/EOL_R: length 20.6
  Top Layer w0.254: 23.78,46.92 24.29,47.43 24.64,47.43 25.74,46.34 u3.6 ; 23.78,46.92 23.78,47.18 23.47,47.49 21.11,47.49 ; 23.78,46.92 23.78,45.14 26.78,42.15 26.96,42.15 ; 26.96,42.15 25.74,40.93 u3.3 ; 26.96,42.15 27.34,42.15 27.59,41.89 11.2 ; j2.3 21.1,47.5 21.11,47.49 ; 21.11,47.49 19.47,47.49 13.2
/BROTHER-CONNECTORS/EOL_R_N: length 9.6
  Top Layer w0.254: jhmk.2 17.7,44.19 17.7,42.92 17.95,42.66 18.97,42.66 19.22,42.41 19.22,41.39 19.47,41.14 21.24,41.14 28.1 22.9,40.38 u3.1
/BROTHER-CONNECTORS/EOL_R_S: length 11.9
  Top Layer w0.254: 30.1 28.61,43.43 28.61,43.67 ; u3.7 24.55,46 24.55,45.75 26.63,43.67 28.61,43.67 ; 28.61,43.67 29.37,44.43 29.37,46.97 29.63,47.23 30.9,47.23 19.1
/BROTHER-CONNECTORS/SOL_0: length 3.2
  Top Layer w0.254: j3.5 19.69,12.78 U4.16
/BROTHER-CONNECTORS/SOL_1: length 4.5
  Top Layer w0.254: j3.6 23.11,14.21 23.61,14.21 24.26,14.86 ul1.10
/BROTHER-CONNECTORS/SOL_2: length 4
  Top Layer w0.254: ul1.11 25.53,14.62 j3.7
/BROTHER-CONNECTORS/SOL_3: length 3.7
  Top Layer w0.254: ul1.12 26.8,13.89 j3.8
/BROTHER-CONNECTORS/SOL_4: length 3.4
  Top Layer w0.254: ul1.13 28.07,13.16 j3.9
/BROTHER-CONNECTORS/SOL_5: length 3.2
  Top Layer w0.254: j3.10 29.34,12.72 ul1.14
/BROTHER-CONNECTORS/SOL_6: length 3.5
  Top Layer w0.254: j3.11 30.61,13.44 ul1.15
/BROTHER-CONNECTORS/SOL_7: length 3.8
  Top Layer w0.254: j3.12 31.88,14.17 ul1.16
/BROTHER-CONNECTORS/SOL_8: length 3.3
  Top Layer w0.254: un2.15 7.83,28.83 j1.5
/BROTHER-CONNECTORS/SOL_9: length 3.2
  Top Layer w0.254: un2.16 7.64,27.56 j1.6
/BROTHER-CONNECTORS/SOL_A: length 5.6
  Top Layer w0.254: 10.79,17.53 12.06,16.26 U4.10
  Bottom Layer w0.254: j1.11 7.48,17.4 v1(10.54,17.4)
/BROTHER-CONNECTORS/SOL_B: length 7.3
  Top Layer w0.254: U4.11 13.33,15.11 12.45,14.22 8.43,14.22 j1.12
/BROTHER-CONNECTORS/SOL_C: length 4.7
  Top Layer w0.254: j3.1 11.79,12.89 12.06,12.89 13.28,14.1 13.59,14.1 14.6,15.11 U4.12
/BROTHER-CONNECTORS/SOL_D: length 4.1
  Top Layer w0.254: j3.2 15.88,14.97 U4.13
/BROTHER-CONNECTORS/SOL_E: length 3.8
  Top Layer w0.254: j3.3 17.14,14.24 U4.14
/BROTHER-CONNECTORS/SOL_F: length 3.5
  Top Layer w0.254: U4.15 18.41,13.51 j3.4
/ESP32/ENC_A: length 37.6
  Top Layer w0.254: NOREF#25.1 39.88,23.75 37.55,23.75 ; 37.55,23.75 36.7,23.75 36.07,24.38 v1(35.98,24.38) ; 37.55,23.75 37.59,23.71 37.59,23.05 ; 31.58,51.14 31.29,51.44 5.2 ; 31.58,51.14 32.05,50.67 34.8,50.67 35.8,49.67 v1(35.8,46.1) ; 31.58,51.14 32,51.56 14.1
  Bottom Layer w0.254: v1(35.98,24.38) 35.98,45.92 v1(35.8,46.1)
/ESP32/ENC_B: length 38.7
  Top Layer w0.254: 37.57,20.83 37.59,20.8 37.59,20 ; 37.57,20.83 36.58,20.83 35.28,22.12 35.28,23.26 v1(35.05,23.5) ; 37.57,20.83 39.5,20.83 NOREF#12.1 ; v1(34.92,45.97) 34.92,48.39 34.54,48.77 32.52,48.77 32.01,49.28 32.01,49.66 ; 15.1 32.01,49.66 ; 32.01,49.66 31.76,49.91 6.2
  Bottom Layer w0.254: v1(35.05,23.5) 35.05,45.85 v1(34.92,45.97)
/ESP32/ENC_BP: length 38.2
  Top Layer w0.254: NOREF#4.1 39.12,25.53 37.34,25.53 v1(36.96,25.15) 36.58,25.53 C1aaaz.1 ; v1(36.7,46.23) 36.7,49.53 35.56,50.67 35.56,52.07 35.18,52.45 32.17,52.45 31.53,53.09 30.22,53.09 R1dfghdf.2
  Bottom Layer w0.254: v1(36.96,25.15) 36.96,45.97 v1(36.7,46.23)
/ESP32/EOL_L_N: length 34.2
  Top Layer w0.254: 37.05,41.66 34.04,41.66 30.53,38.15 v1(22.3,38.15) ; 37.05,41.66 40,41.66 NOREF#26.1 ; 37.05,41.66 37.08,41.62 37.08,40.83 ; 40.1 14.76,42.04 v1(14.76,42.77) 29.2
  Bottom Layer w0.254: v1(14.76,42.77) 14.1,42.77 13.92,42.59 13.92,40.26 14.51,39.66 17.49,39.66 18.8,38.35 22.1,38.35 v1(22.3,38.15)
/ESP32/EOL_L_P: length 39.3
  Top Layer w0.254: 42.1 27.2 5.12,40 5.63,39.5 ; 35.31,39.43 35.31,38.76 35.33,38.73 ; 35.33,38.73 39.62,38.73 NOREF#15.1 ; 35.33,38.73 31.75,38.73 30.61,37.59 23.11,37.59 22.86,37.34 21.34,37.34 v1(21.21,37.47)
  Bottom Layer w0.254: v1(5.87,39.29) 17.35,39.29 18.67,37.97 20.7,37.97 v1(21.21,37.47)
/ESP32/EOL_R_N: length 14.9
  Top Layer w0.254: 30.2 30.13,42.61 ; 30.13,42.61 30.13,41.9 41.1 ; 30.13,42.61 30.19,42.67 32.49,42.67 33.55,43.74 33.55,44.48 34.04,44.96 36.99,44.96 ; 36.96,44.13 36.99,44.17 36.99,44.96 ; NOREF#16.1 39.75,46.86 38.61,45.72 38.61,45.21 38.35,44.96 36.99,44.96
/ESP32/EOL_R_P: length 25.3
  Top Layer w0.254: 35.04,42.04 33.78,42.04 30.48,38.73 22.67,38.73 22.54,38.86 22.06,38.86 21.93,38.73 21.72,38.73 20.83,39.62 20.83,39.91 20.49,40.25 28.2 43.1 ; 35.04,42.04 37.97,42.04 40.13,44.2 NOREF#24.1 ; 35.04,42.04 35.05,42.05 35.05,42.73
/SOLENOID DRIVERS/MCU_SOL_0: length 10.8
  Top Layer w0.254: MCP23017.8 24.66,28.9 20.09,24.33 20.09,21.56 U4.1
/SOLENOID DRIVERS/MCU_SOL_1: length 8.8
  Top Layer w0.254: ul1.7 23.65,21.76 23.65,27.23 24.66,28.25 MCP23017.7
/SOLENOID DRIVERS/MCU_SOL_2: length 8.4
  Top Layer w0.254: v1(25.53,23.63) ul1.6 ; MCP23017.6 26.7,27.6 v1(27.2,27.09)
  Bottom Layer w0.254: v1(25.53,23.63) 27.2,25.31 v1(27.2,27.09)
/SOLENOID DRIVERS/MCU_SOL_3: length 11.1
  Top Layer w0.254: MCP23017.5 24.66,26.95 24.16,26.44 24.16,22.88 24.92,22.12 24.92,20.09 25.17,19.83 25.74,19.83 26.75,20.85 26.75,21.11 ul1.5
/SOLENOID DRIVERS/MCU_SOL_4: length 15.9
  Top Layer w0.254: MCP23017.4 28.3,26.3 32.54,22.06 32.54,20.29 32.03,19.78 28.98,19.78 28.07,20.69 ul1.4
/SOLENOID DRIVERS/MCU_SOL_5: length 6.8
  Top Layer w0.254: MCP23017.3 26.95,25.65 29.34,23.26 ul1.3
/SOLENOID DRIVERS/MCU_SOL_6: length 7.1
  Top Layer w0.254: v1(28.47,23.22) 26.69,25 MCP23017.2 ; ul1.2 30.61,21.79 30.5,21.89 30.5,22.2 v1(29.99,22.71)
  Bottom Layer w0.254: v1(28.47,23.22) 29.49,23.22 v1(29.99,22.71)
/SOLENOID DRIVERS/MCU_SOL_7: length 8.1
  Top Layer w0.254: ul1.1 31.88,21.7 v1(31.26,22.31) ; MCP23017.1 26.44,24.35 28.47,22.31 v1(28.72,22.31)
  Bottom Layer w0.254: v1(31.26,22.31) 31.01,22.06 28.98,22.06 v1(28.72,22.31)
/SOLENOID DRIVERS/MCU_SOL_8: length 2.9
  Top Layer w0.254: un2.2 16.02,28.9 MCP23017.21
/SOLENOID DRIVERS/MCU_SOL_9: length 3.1
  Top Layer w0.254: MCP23017.22 17.75,28.25 17.06,27.56 un2.1
/SOLENOID DRIVERS/MCU_SOL_A: length 9.8
  Top Layer w0.254: U4.7 12.16,21.25 12.16,22.02 17.75,27.6 MCP23017.23
/SOLENOID DRIVERS/MCU_SOL_B: length 8.6
  Top Layer w0.254: U4.6 13.43,21.25 13.43,22.64 17.75,26.95 MCP23017.24
/SOLENOID DRIVERS/MCU_SOL_C: length 7.5
  Top Layer w0.254: 18.77,26.3 17.75,26.3 14.6,23.16 U4.5
/SOLENOID DRIVERS/MCU_SOL_D: length 6.3
  Top Layer w0.254: MCP23017.26 17.75,25.65 15.97,23.88 15.97,21.25 U4.4
/SOLENOID DRIVERS/MCU_SOL_E: length 5.1
  Top Layer w0.254: MCP23017.27 17.75,25 17.14,24.4 U4.3
/SOLENOID DRIVERS/MCU_SOL_F: length 4.5
  Top Layer w0.254: MCP23017.28 17.91,24.35 17.65,24.1 17.65,23.77 18.41,23.01 U4.2
BUZZER: length 27
  Top Layer w0.254: un2.6 v1(21.21,33.91) ; NOREF#8.1 40,34.16 36.45,30.61 32.26,30.61 29.08,33.78 v1(27.43,33.78)
  Bottom Layer w0.254: v1(27.43,33.78) 27.3,33.91 v1(21.21,33.91)
BUZZER12V: length 3.4
  Top Layer w0.254: j1.3 8.4,33.29 9.02,33.91 un2.11
NET-(U703A1--): length 7.5
  Top Layer w0.254: u2.2 9.1,41.06 7.87,42.29 6.5,42.29 3.1 5.48,42.8 5.48,44.2 ghfg.1
NET-(U703A--): length 7.5
  Top Layer w0.254: jhmk.1 20.85,44.06 20.85,42.66 4.1 21.87,42.16 23.24,42.16 24.47,40.93 u3.2
NET-(U703B1-+): length 9.1
  Top Layer w0.254: 18.2 17.05,45.86 17.05,47.12 16.29,47.88 14,47.88 13.25,47.13 20.1 12.03,46.61 u2.5
NET-(U703B-+): length 9.1
  Top Layer w0.254: 19.2 32.42,45.72 32.42,46.98 31.66,47.74 29.37,47.74 28.62,46.99 21.1 27.4,46.47 u3.5
SPARE: length 28.4
  Top Layer w0.254: un2.7 v1(21.21,35.18) ; NOREF#10.1 34.16,31.11 32.79,31.11 28.37,35.54 27.79,35.54 v1(27.43,35.18)
  Bottom Layer w0.254: v1(21.21,35.18) v1(27.43,35.18)
SPARE12V: length 4
  Top Layer w0.254: un2.10 9.4,35.18 7.37,37.21 j1.1
$1N476: length 3.2
  Top Layer w0.254: 17.1 18.46,43.43 8.2 4.2
$1N1029: length 3.7
  Top Layer w0.254: 21.2 24.1 26.2
$1N4761: length 3.2
  Top Layer w0.254: 16.1 3.09,43.56 7.2 3.2
$1N10291: length 3.7
  Top Layer w0.254: 20.2 23.1 25.2

## Copper pours and planes (outline as drawn; the poured copper is in the pictures)
GND on Top Layer: -15.37,71.37 94.23,71.37 94.23,-12.7 -15.37,-12.7
GND on Bottom Layer: -4.19,58.42 78.36,58.42 78.36,-1.78 -4.19,-1.78
GND on Bottom Layer: -19.81,67.82 84.96,67.82 84.96,-10.29 -19.81,-10.29

## Text on the board
Top Silkscreen Layer: copper / smelter / relay? | Ea-nāṣir
